# Altium project AMS_Master.PrjPCB
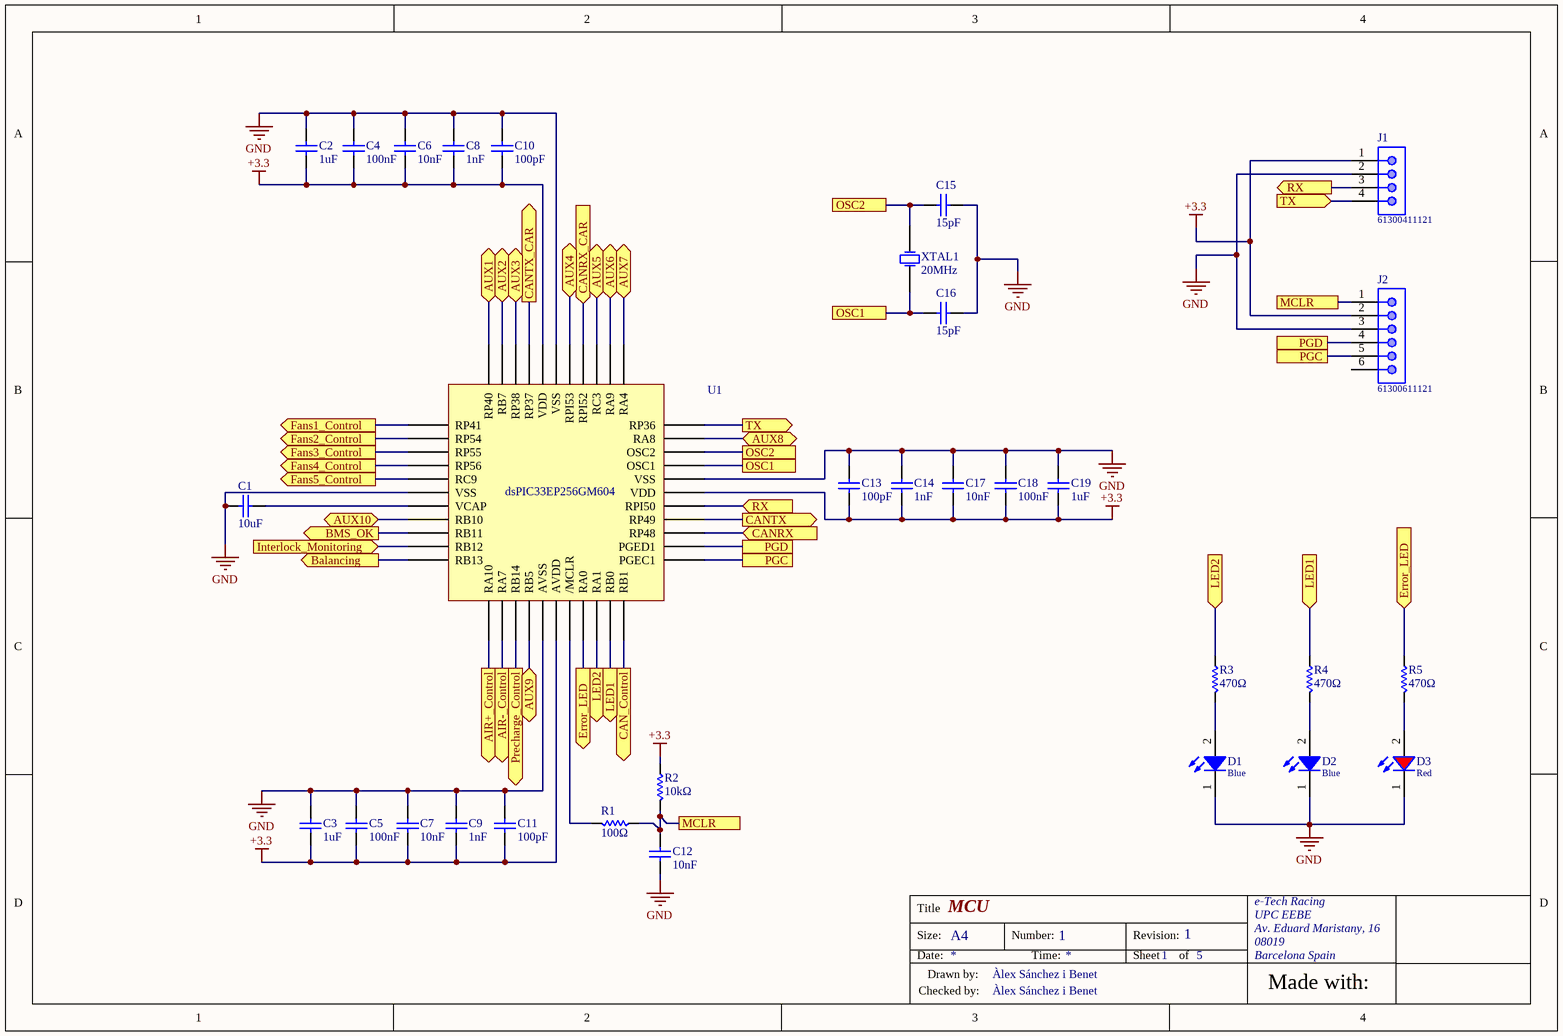
[diagram p0: AMS_MCU.SchDoc]
5 sheets, 95 parts. Net scope: flat (ports and power ports of the same name join across sheets).
Board file: AMS_Master.PcbDoc
Sheets:
  AMS_MCU.SchDoc
  AMS_supply.SchDoc
  AMS_Control.SchDoc
  AMS_Control_2.SchDoc
  AMS_CAN.SchDoc

## Sheet AMS_MCU.SchDoc: MCU
size A4; CheckedBy: Àlex Sánchez i Benet; DrawnBy: Àlex Sánchez i Benet; DocumentNumber: 1; Revision: 1; SheetNumber: 1; SheetTotal: 5; University: UPC EEBE; City: Barcelona; Country: Spain; CP: 08019; Address: Av. Eduard Maristany, 16

### Parts
C1  10uF  [0805_2x1.25x1.25mm_Reflow Soldering]
C2  1uF  [0805_2x1.25x1.25mm_Reflow Soldering]
C3  1uF  [0805_2x1.25x1.25mm_Reflow Soldering]
C4  100nF  [0805_2x1.25x0.8mm_Reflow Soldering]
C5  100nF  [0805_2x1.25x0.8mm_Reflow Soldering]
C6  10nF  [0805_2x1.25x0.8mm_Reflow Soldering]
C7  10nF  [0805_2x1.25x0.8mm_Reflow Soldering]
C8  1nF  [0805_2x1.25x0.8mm_Reflow Soldering]
C9  1nF  [0805_2x1.25x0.8mm_Reflow Soldering]
C10  100pF  [0805_2x1.25x0.6mm_Reflow Soldering]
C11  100pF  [0805_2x1.25x0.6mm_Reflow Soldering]
C12  10nF  [0805_2x1.25x0.8mm_Reflow Soldering]
C13  100pF  [0805_2x1.25x0.6mm_Reflow Soldering]
C14  1nF  [0805_2x1.25x0.8mm_Reflow Soldering]
C15  15pF  [0805_2x1.25x0.6mm_Reflow Soldering]
C16  15pF  [0805_2x1.25x0.6mm_Reflow Soldering]
C17  10nF  [0805_2x1.25x0.8mm_Reflow Soldering]
C18  100nF  [0805_2x1.25x0.8mm_Reflow Soldering]
C19  1uF  [0805_2x1.25x1.25mm_Reflow Soldering]
D1  Blue  [WL-SMCW_0805]
D2  Blue  [WL-SMCW_0805]
D3  Red  [WL-SMCW_0805]
J1  61300411121  [61300411121]
J2  61300611121  [61300611121]
R1  100Ω  [CR0805]
R2  10kΩ  [CR0805]
R3  470Ω  [CR0805]
R4  470Ω  [CR0805]
R5  470Ω  [CR0805]
U1  dsPIC33EP256GM604  [dsPIC33EP256GM604]
XTAL1  20MHz  [830028710]

### Ports
AIR+_Control (out), AIR-_Control (out), AUX1 (bidir), AUX2 (bidir), AUX3 (bidir), AUX4 (bidir), AUX5 (bidir), AUX6 (bidir), AUX7 (bidir), AUX8 (bidir), AUX9 (bidir), AUX10 (bidir), Balancing (out), BMS_OK (out), CAN_Control (out), CANRX (in), CANRX_CAR (in), CANTX (out), CANTX_CAR (out), Error_LED (in), Error_LED (out), Fans1_Control (out), Fans2_Control (out), Fans3_Control (out), Fans4_Control (out), Fans5_Control (out), Interlock_Monitoring (in), LED1 (in), LED1 (out), LED2 (in), LED2 (out), MCLR, OSC1, OSC2, PGC, PGD, Precharge_Control (out), RX (in), RX (out), TX (in), TX (out)

### Nets
+3.3: C2.1 C3.1 C4.1 C5.1 C6.1 C7.1 C8.1 C9.1 C10.1 C11.1 C13.1 C14.1 C17.1 C18.1 C19.1 J1.1 J2.2 R2.2 U1.17(AVDD) U1.28(VDD) U1.40(VDD)
GND: C1.2 C2.2 C3.2 C4.2 C5.2 C6.2 C7.2 C8.2 C9.2 C10.2 C11.2 C12.1 C13.2 C14.2 C15.2 C16.2 C17.2 C18.2 C19.2 D1.1(K) D2.1(K) D3.1(K) J1.2 J2.3 U1.6(VSS) U1.16(AVSS) U1.29(VSS) U1.39(VSS)
NetC1_1: C1.1 U1.7(VCAP)
NetC12_2: C12.2 J2.1 R1.2 R2.1 ; port MCLR
NetC15_1: C15.1 U1.31(OSC2) XTAL1.2(OSC2) ; port OSC2
NetC16_1: C16.1 U1.30(OSC1) XTAL1.1(OSC1) ; port OSC1
NetC23_2: U1.10(RB12) ; port Interlock_Monitoring
NetD1_2: D1.2(A) R3.1
NetD2_2: D2.2(A) R4.1
NetD3_2: D3.2(A) R5.1
NetD13_1: U1.11(RB13) ; port Balancing
NetJ1_3: J1.3 U1.27(RPI50) ; port RX
NetJ1_4: J1.4 U1.33(RP36) ; port TX
NetJ2_4: J2.4 U1.24(PGED1) ; port PGD
NetJ2_5: J2.5 U1.23(PGEC1) ; port PGC
NetQ1_1: U1.12(RA10) ; port AIR+_Control
NetQ2_1: U1.13(RA7) ; port AIR-_Control
NetQ3_1: U1.14(RB14) ; port Precharge_Control
NetQ4_1: U1.9(RB11) ; port BMS_OK
NetQ5_1: U1.1(RP41) ; port Fans1_Control
NetQ6_1: U1.2(RP54) ; port Fans2_Control
NetQ7_1: U1.22(RB1) ; port CAN_Control
NetR1_1: R1.1 U1.18(/MCLR)
NetR3_2: R3.2 U1.20(RA1) ; port LED2
NetR4_2: R4.2 U1.21(RB0) ; port LED1
NetR5_2: R5.2 U1.19(RA0) ; port Error_LED
NetU1_3: U1.3(RP55) ; port Fans3_Control
NetU1_4: U1.4(RP56) ; port Fans4_Control
NetU1_5: U1.5(RC9) ; port Fans5_Control
NetU1_8: U1.8(RB10) ; port AUX10
NetU1_15: U1.15(RB5) ; port AUX9
NetU1_25: U1.25(RP48) ; port CANRX
NetU1_26: U1.26(RP49) ; port CANTX
NetU1_32: U1.32(RA8) ; port AUX8
NetU1_34: U1.34(RA4) ; port AUX7
NetU1_35: U1.35(RA9) ; port AUX6
NetU1_36: U1.36(RC3) ; port AUX5
NetU1_37: U1.37(RPI52) ; port CANRX_CAR
NetU1_38: U1.38(RPI53) ; port AUX4
NetU1_41: U1.41(RP37) ; port CANTX_CAR
NetU1_42: U1.42(RP38) ; port AUX3
NetU1_43: U1.43(RB7) ; port AUX2
NetU1_44: U1.44(RP40) ; port AUX1

Not connected (* = marked no-connect by the designer): J2 6

### Notes on the sheet
- Title
- e-Tech Racing
- UPC EEBE
- Size:
- Date:
- Drawn by:
- A4
- Number:
- Time:
- Revision:
- Sheet
- of
- Av. Eduard Maristany, 16
- 08019
- Barcelona Spain
- Made with:
- Checked by:

### Library data of the parts
C1 = 885012107014: WCAP-CSGP Ceramic Capacitors, 0805, X5R, 16V, 10uF; Rated Voltage: 16V DC; ComponentLink1Description: Manufacturer; ComponentLink1URL: http://www.we-online.de; ComponentLink2Description: Datasheet; ComponentLink2URL: http://katalog.we-online.de/pbs/datasheet/885012107014.pdf; Part Number: 885012107014; Published Date: Oct. 2017; Publisher: Wurth Elektronik; Size: 0805; Operating Temperature: -55 °C to +125 °C; Value: 10uF; Ceramic Type: X5R
C2 C3 C19 = 885012207103: WCAP-CSGP Ceramic Capacitors, 0805, X7R, 50V, 1uF; Rated Voltage: 50V DC; ComponentLink1Description: Manufacturer; ComponentLink1URL: http://www.we-online.de; ComponentLink2Description: Datasheet; ComponentLink2URL: http://katalog.we-online.de/pbs/datasheet/885012207103.pdf; Part Number: 885012207103; Publisher: Wurth Elektronik; Size: 0805; Operating Temperature: -55 °C to +125 °C; Value: 1uF; Ceramic Type: X7R
C4 C5 C18 = 885012207098: WCAP-CSGP Ceramic Capacitors, 0805, X7R, 50V, 100nF; Rated Voltage: 50V DC; ComponentLink1Description: Manufacturer; ComponentLink1URL: http://www.we-online.de; ComponentLink2Description: Datasheet; ComponentLink2URL: http://katalog.we-online.de/pbs/datasheet/885012207098.pdf; Part Number: 885012207098; Publisher: Wurth Elektronik; Size: 0805; Operating Temperature: -55 °C to +125 °C; Value: 100nF; Ceramic Type: X7R
C6 C7 C12 C17 = 885012207092: WCAP-CSGP Ceramic Capacitors, 0805, X7R, 50V, 10nF; Rated Voltage: 50V DC; ComponentLink1Description: Manufacturer; ComponentLink1URL: http://www.we-online.de; ComponentLink2Description: Datasheet; ComponentLink2URL: http://katalog.we-online.de/pbs/datasheet/885012207092.pdf; Part Number: 885012207092; Publisher: Wurth Elektronik; Size: 0805; Operating Temperature: -55 °C to +125 °C; Value: 10nF; Ceramic Type: X7R
C8 C9 C14 = 885012007063: WCAP-CSGP Ceramic Capacitors, 0805, NP0, 50V, 1nF; Rated Voltage: 50V DC; ComponentLink1Description: Manufacturer; ComponentLink1URL: http://www.we-online.de; ComponentLink2Description: Datasheet; ComponentLink2URL: http://katalog.we-online.de/pbs/datasheet/885012007063.pdf; Part Number: 885012007063; Published Date: Oct. 2017; Publisher: Wurth Elektronik; Size: 0805; Operating Temperature: -55 °C to +125 °C; Value: 1nF; Ceramic Type: NP0
C10 C11 C13 = 885012007057: WCAP-CSGP Ceramic Capacitors, 0805, NP0, 50V, 100pF; Rated Voltage: 50V DC; ComponentLink1Description: Manufacturer; ComponentLink1URL: http://www.we-online.de; ComponentLink2Description: Datasheet; ComponentLink2URL: http://katalog.we-online.de/pbs/datasheet/885012007057.pdf; Part Number: 885012007057; Published Date: Oct. 2017; Publisher: Wurth Elektronik; Size: 0805; Operating Temperature: -55 °C to +125 °C; Value: 100pF; Ceramic Type: NP0
C15 C16 = 885012007052: WCAP-CSGP Ceramic Capacitors, 0805, NP0, 50V, 15pF; Rated Voltage: 50V DC; ComponentLink1Description: Manufacturer; ComponentLink1URL: http://www.we-online.de; ComponentLink2Description: Datasheet; ComponentLink2URL: http://katalog.we-online.de/pbs/datasheet/885012007052.pdf; Part Number: 885012007052; Published Date: Oct. 2017; Publisher: Wurth Elektronik; Size: 0805; Operating Temperature: -55 °C to +125 °C; Value: 15pF; Ceramic Type: NP0
D1 D2 = 150080BS75000: SMT Mono-color Chip LED Waterclear WL-SMCW, size 0805, Blue, 3.2 V, 140 deg, 145 mcd; Forward Voltage: 3.2 V; Viewing Angle: 140 deg; Peak Wavelength: 465 nm; Dominant Wavelength: 470 nm; Luminous Intensity: 145 mcd; Chip Technology: InGaN; ComponentLink1Description: Manufacturer; ComponentLink1URL: http://www.we-online.de; ComponentLink2Description: Datasheet; ComponentLink2URL: https://katalog.we-online.de/led/datasheet/150080BS75000.pdf; Part Number: 150080BS75000; Published Date: November 2018; Publisher: Wurth Elektronik; Size: 0805; Operating Temperature: -40 to 85 degC; Emitting Color: Blue; Mounting Technology: SMT; Packaging: Tape and Reel
D3 = 150080RS75000: SMT Mono-color Chip LED Waterclear WL-SMCW, size 0805, Red, 2 V, 140 deg, 150 mcd; Forward Voltage: 2 V; Viewing Angle: 140 deg; Peak Wavelength: 630 nm; Dominant Wavelength: 625 nm; Luminous Intensity: 150 mcd; Chip Technology: AlInGaP; ComponentLink1Description: Manufacturer; ComponentLink1URL: http://www.we-online.de; ComponentLink2Description: Datasheet; ComponentLink2URL: https://katalog.we-online.de/led/datasheet/150080RS75000.pdf; Part Number: 150080RS75000; Published Date: November 2018; Publisher: Wurth Elektronik; Size: 0805; Operating Temperature: -40 to 85 degC; Emitting Color: Red; Mounting Technology: SMT; Packaging: Tape and Reel
J1 = 61300411121: THT Vertical Pin Header WR-PHD, Pitch 2.54 mm, Single Row, 4 pins; Pin Number: 4; Pitch: 2.54 mm; Gender: Male; Rated Current: 3 A; Working Voltage: 250 VAC; Withstanding Voltage: 500 VAC; Contact Resistance: 20 mOhm; ComponentLink1Description: Manufacturer; ComponentLink1URL: http://www.we-online.de; ComponentLink2Description: Datasheet; ComponentLink2URL: https://katalog.we-online.de/em/datasheet/6130xx11121.pdf; Part Number: 61300411121; Published Date: August 2018; Publisher: Wurth Elektronik; Operating Temperature: -40 to 105 degC; Mounting Technology: THT; Packaging: Bag; Row Number: Single; Orientation: Vertical
J2 = 61300611121: THT Vertical Pin Header WR-PHD, Pitch 2.54 mm, Single Row, 6 pins; Pin Number: 6; Pitch: 2.54 mm; Gender: Male; Rated Current: 3 A; Working Voltage: 250 VAC; Withstanding Voltage: 500 VAC; Contact Resistance: 20 mOhm; ComponentLink1Description: Manufacturer; ComponentLink1URL: http://www.we-online.de; ComponentLink2Description: Datasheet; ComponentLink2URL: https://katalog.we-online.de/em/datasheet/6130xx11121.pdf; Part Number: 61300611121; Published Date: August 2018; Publisher: Wurth Elektronik; Operating Temperature: -40 to 105 degC; Mounting Technology: THT; Packaging: Bag; Row Number: Single; Orientation: Vertical
R1 = CR0805-FX-1000ELF: Chip Resistor 0805; Manufacturer: Bourns; ComponentLink1Description: Datasheet; ComponentLink1URL: https://www.bourns.com/docs/product-datasheets/chpreztr.pdf?sfvrsn=566c91f1_11
R2 = CR0805-JW-103ELF: Chip Resistor 0805; Manufacturer: Bourns; ComponentLink1Description: Datasheet; ComponentLink1URL: https://www.bourns.com/docs/product-datasheets/chpreztr.pdf?sfvrsn=566c91f1_11
R3-R5 = CR0805-FX-4700GLF: Chip Resistor 0805; Manufacturer: Bourns; ComponentLink1Description: Datasheet; ComponentLink1URL: https://www.bourns.com/docs/product-datasheets/chpreztr.pdf?sfvrsn=566c91f1_11
U1 = dsPIC33EP256GM604: 16-Bit Digital Signal Controller with High-Speed PWM, Op Amps and Advanced Analog Features; Manufacturer: Microchip; Pins: 44; ComponentLink1Description: Datasheet; ComponentLink1URL: http://ww1.microchip.com/downloads/en/DeviceDoc/70000689d.pdf
XTAL1 = 830028710: Industry standard SMD crystal WE-XTAL Quartz Crystal; Manufacturer: Wurth Elektronik; Model: HC49/4HSMX; ComponentLink1Description: Datasheet; ComponentLink1URL: https://katalog.we-online.com/pbs/datasheet/830028710.pdf; Mounting Technology: SMT; Frequency: 20MHz

## Sheet AMS_supply.SchDoc: Supply Circuit
size A4; CheckedBy: Àlex Sánchez i Benet; DrawnBy: Àlex Sánchez i Benet; DocumentNumber: 1; Revision: 1; SheetNumber: 2; SheetTotal: 5; University: UPC EEBE; City: Barcelona; Country: Spain; CP: 08019; Address: Av. Eduard Maristany, 16
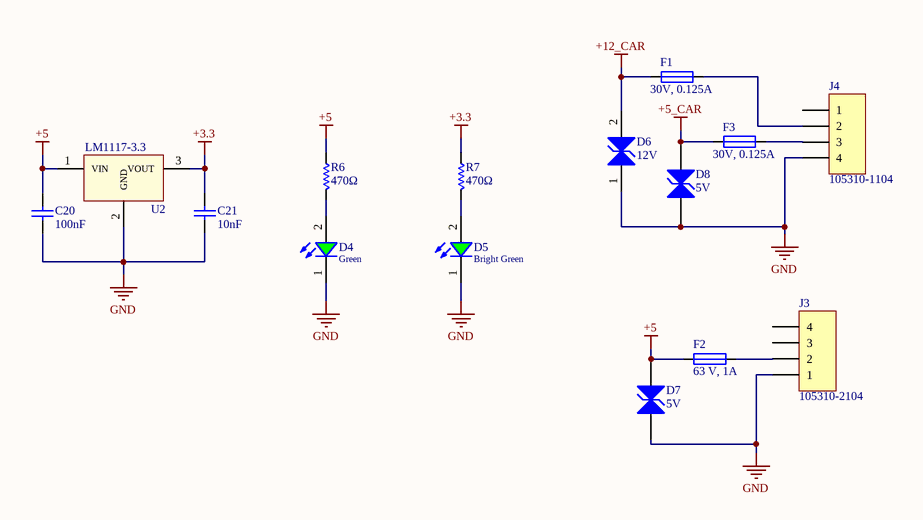
[diagram p1: AMS_supply.SchDoc]

### Parts
C20  100nF  [0805_2x1.25x0.8mm_Reflow Soldering]
C21  10nF  [0805_2x1.25x0.8mm_Reflow Soldering]
D4  Green  [WL-SMCW_0805]
D5  Bright Green  [WL-SMCW_0805]
D6  12V  [WE-TVSP_DO-214AC_Bidirectional]
D7  5V  [WE-TVSP_DO-214AC_Bidirectional]
D8  5V  [WE-TVSP_DO-214AC_Bidirectional]
F1  30V, 0.125A  [1206L012]
F2  63 V, 1A  [437 Series]
F3  30V, 0.125A  [1206L012]
J3  105310-2104  [105310-2104]
J4  105310-1104  [105310-1104]
R6  470Ω  [CR0805]
R7  470Ω  [CR0805]
U2  Reference: LM1117-3.3  [LM1117IMP3.3]  (hidden comment: 1.5 - 13.8 Vin, 3.3 Vout)

### Nets
+3.3: C21.2 R7.2 U2.3(VOUT)
+5: C20.2 D7.2(C) F2.1 R6.2 U2.1(VIN)
+5_CAR: D8.2(C) F3.1
+12_CAR: D6.2(C) F1.1
GND: C20.1 C21.1 D4.1(K) D5.1(K) D6.1(C) D7.1(C) D8.1(C) J3.1 J4.4 U2.2(GND)
NetD4_2: D4.2(A) R6.1
NetD5_2: D5.2(A) R7.1
NetF1_2: F1.2 J4.2
NetF2_2: F2.2 J3.2
NetF3_2: F3.2 J4.3

Not connected (* = marked no-connect by the designer): J3 3 4; J4 1

### Notes on the sheet
- Title
- e-Tech Racing
- UPC EEBE
- Size:
- Date:
- Drawn by:
- A4
- Number:
- Time:
- Revision:
- Sheet
- of
- Av. Eduard Maristany, 16
- 08019
- Barcelona Spain
- Made with:
- Checked by:

### Library data of the parts
C20 = 885012207098: as C4 on sheet AMS_MCU; ComponentLink1Description: Manufacturer; ComponentLink1URL: http://www.we-online.de; ComponentLink2Description: Datasheet; ComponentLink2URL: http://katalog.we-online.de/pbs/datasheet/885012207098.pdf; Part Number: 885012207098; Publisher: Wurth Elektronik; Size: 0805; Operating Temperature: -55 °C to +125 °C; Value: 100nF; Ceramic Type: X7R
C21 = 885012207092: as C6 on sheet AMS_MCU; ComponentLink1Description: Manufacturer; ComponentLink1URL: http://www.we-online.de; ComponentLink2Description: Datasheet; ComponentLink2URL: http://katalog.we-online.de/pbs/datasheet/885012207092.pdf; Part Number: 885012207092; Publisher: Wurth Elektronik; Size: 0805; Operating Temperature: -55 °C to +125 °C; Value: 10nF; Ceramic Type: X7R
D4 = 150080GS75000: SMT Mono-color Chip LED Waterclear WL-SMCW, size 0805, Green, 3.2 V, 140 deg, 450 mcd; Forward Voltage: 3.2 V; Viewing Angle: 140 deg; Peak Wavelength: 515 nm; Dominant Wavelength: 525 nm; Luminous Intensity: 450 mcd; Chip Technology: InGaN; ComponentLink1Description: Manufacturer; ComponentLink1URL: http://www.we-online.de; ComponentLink2Description: Datasheet; ComponentLink2URL: https://katalog.we-online.de/led/datasheet/150080GS75000.pdf; Part Number: 150080GS75000; Published Date: November 2018; Publisher: Wurth Elektronik; Size: 0805; Operating Temperature: -40 to 85 degC; Emitting Color: Green; Mounting Technology: SMT; Packaging: Tape and Reel
D5 = 150080VS75000: SMT Mono-color Chip LED Waterclear WL-SMCW, size 0805, Bright Green, 2 V, 140 deg, 40 mcd; Forward Voltage: 2 V; Viewing Angle: 140 deg; Peak Wavelength: 572 nm; Dominant Wavelength: 570 nm; Luminous Intensity: 40 mcd; Chip Technology: AlInGaP; ComponentLink1Description: Manufacturer; ComponentLink1URL: http://www.we-online.de; ComponentLink2Description: Datasheet; ComponentLink2URL: https://katalog.we-online.de/led/datasheet/150080VS75000.pdf; Part Number: 150080VS75000; Published Date: November 2018; Publisher: Wurth Elektronik; Size: 0805; Operating Temperature: -40 to 85 degC; Emitting Color: Bright Green; Mounting Technology: SMT; Packaging: Tape and Reel
D6 = 824501121: WE-TVSP Power TVS Diode, size DO-214AC, Bidirectional, 400 W, 12 VDC; Peak Pulse Current: 20.1 A; Power Dissipation: 400 W; Reverse Breakdown Voltage: 14 V; Surge Clamping Voltage: 19.9 V; ComponentLink1Description: Manufacturer; ComponentLink1URL: http://www.we-online.de; ComponentLink2Description: Datasheet; ComponentLink2URL: https://katalog.we-online.de/pbs/datasheet/824501121.pdf; Part Number: 824501121; Publisher: Wurth Elektronik; Size: DO-214AC; Operating Temperature: -65 to 150 degC; Mounting Technology: SMT; Packaging: Tape and Reel; Polarity: Bidirectional; Reverse Stand-Off Voltage: 12 V
D7 D8 = 824501500: WE-TVSP Power TVS Diode, size DO-214AC, Bidirectional, 400 W, 5 VDC; Manufacturer: Wurth Elektronik; Peak Pulse Current: 43.5 A; Power Dissipation: 400 W; Reverse Breakdown Voltage: 6.7 V; Surge Clamping Voltage: 9.2 V; ComponentLink1Description: Manufacturer; ComponentLink1URL: http://www.we-online.de; ComponentLink2Description: Datasheet; ComponentLink2URL: https://katalog.we-online.de/pbs/datasheet/824501500.pdf; Part Number: 824501500; Size: DO-214AC; Operating Temperature: -65ºC to 150 ºC; Mounting Technology: SMT; Packaging: Tape and Reel; Polarity: Bidirectional; Reverse Stand-Off Voltage: 5 V
F1 F3 = 1206L012: 1206L Series; Manufacturer: Littlefuse; ComponentLink1Description: Datasheet; ComponentLink1URL: https://www.littelfuse.com/~/media/electronics/datasheets/resettable_ptcs/littelfuse_ptc_1206l_datasheet.pdf.pdf
F2 = 0437001A: 437A Series Fuse; Manufacturer: Littlefuse; ComponentLink1Description: Datasheet; ComponentLink1URL: https://www.littelfuse.com/~/media/electronics/datasheets/fuses/littelfuse_fuse_437a_datasheet.pdf.pdf
J3 = 105310-2104: Nano-Fit Vertical Header, Through Hole, 2.50mm Pitch, Dual Row, 4 Circuits, Natural; Manufacturer: Molex; Rated Voltage: 250V DC; Rated Current: 6.5A; Operating Temperature: -40° to +105°C; ComponentLink1Description: Datasheet; ComponentLink1URL: https://www.molex.com/webdocs/datasheets/pdf/en-us/1053102104_PCB_HEADERS.pdf
J4 = 105310-1104: Nano-Fit Vertical Header, Through Hole, 2.50mm Pitch, Dual Row, 4 Circuits, Black; Manufacturer: Molex; Rated Voltage: 250V DC; Rated Current: 6.5A; Operating Temperature: -40° to +105°C; ComponentLink2Description: Datasheet; ComponentLink2URL: https://www.molex.com/webdocs/datasheets/pdf/en-us/1053101104_PCB_HEADERS.pdf
R6 R7 = CR0805-FX-4700GLF: Chip Resistor 0805; Manufacturer: Bourns; ComponentLink1Description: Datasheet; ComponentLink1URL: https://www.bourns.com/docs/product-datasheets/chpreztr.pdf?sfvrsn=566c91f1_11
U2 = LM1117IMP-3.3/NOPB: 800-mA Low-Dropout Linear Regulator; Manufacturer: Texas Instruments; Output Voltage: 3.3 V; Output Current: 800 mA; Input Voltage: 1.5-13.8 V; ComponentLink1Description: Datasheet; ComponentLink1URL: http://www.ti.com/lit/ds/symlink/lm1117.pdf

## Sheet AMS_Control.SchDoc: Control Circuit 1
size A4; CheckedBy: Àlex Sánchez i Benet; DrawnBy: Àlex Sánchez i Benet; DocumentNumber: 1; Revision: 1; SheetNumber: 3; SheetTotal: 5; University: UPC EEBE; City: Barcelona; Country: Spain; CP: 08019; Address: Av. Eduard Maristany, 16
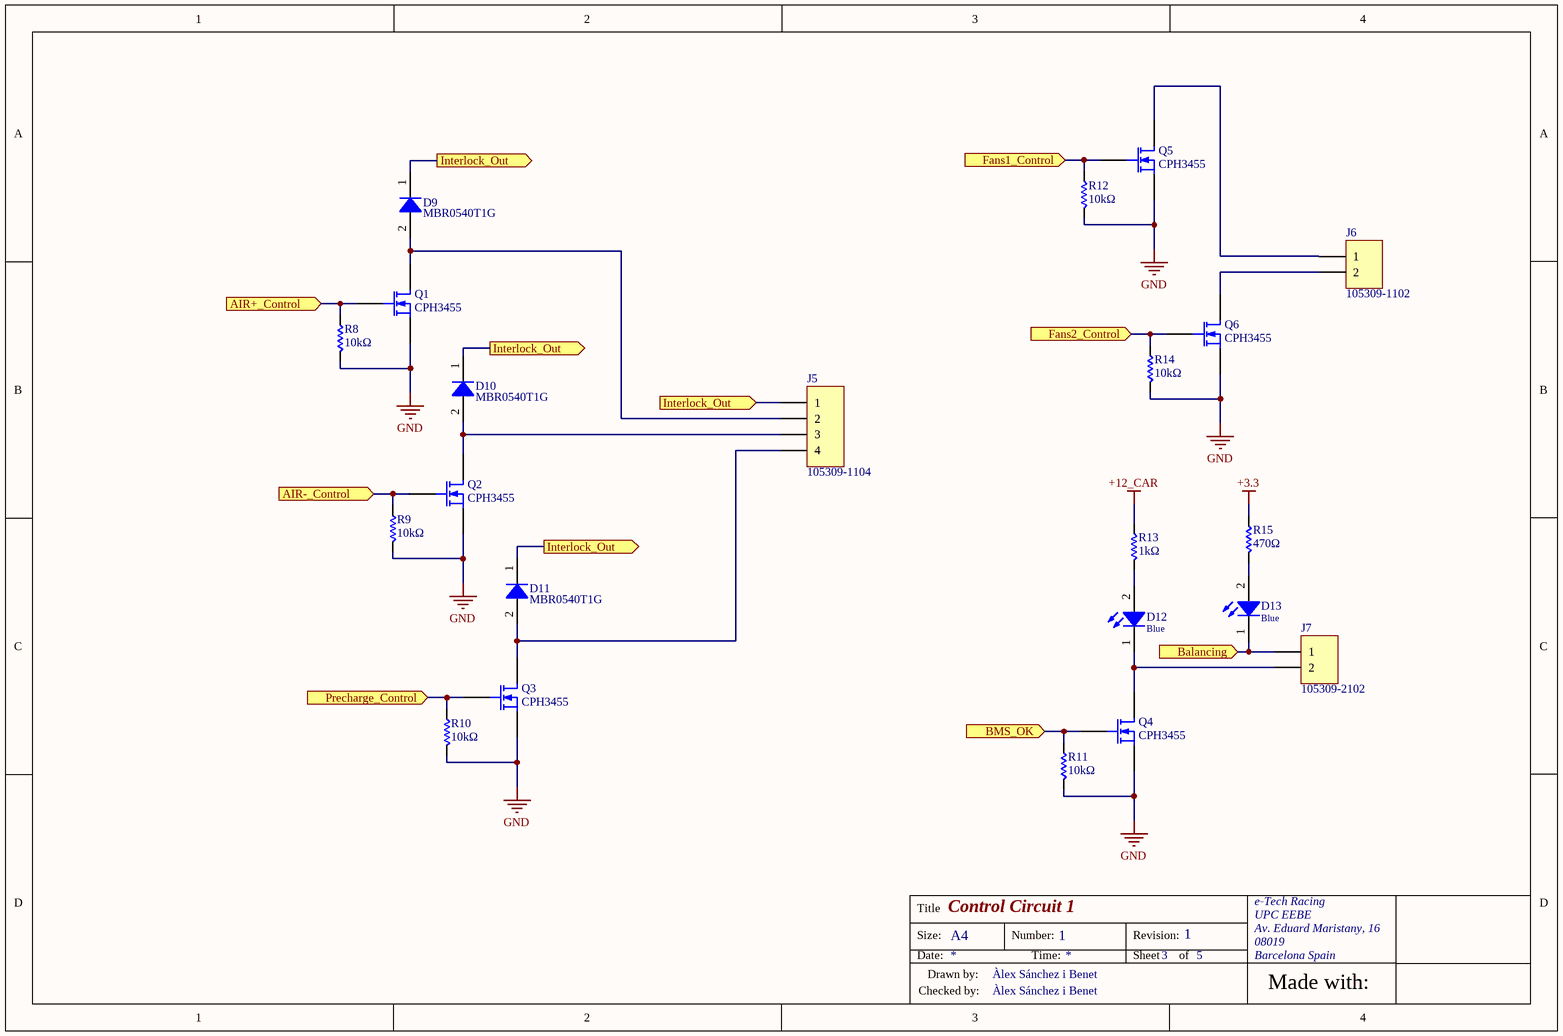
[diagram p2: AMS_Control.SchDoc]

### Parts
D9  MBR0540T1G  [MBR0540T1G]
D10  MBR0540T1G  [MBR0540T1G]
D11  MBR0540T1G  [MBR0540T1G]
D12  Blue  [WL-SMCW_0805]
D13  Blue  [WL-SMCW_0805]
J5  105309-1104  [105309-1104]
J6  105309-1102  [105309-1102]
J7  105309-2102  [105309-2102]
Q1  CPH3455  [CPH3455]
Q2  CPH3455  [CPH3455]
Q3  CPH3455  [CPH3455]
Q4  CPH3455  [CPH3455]
Q5  CPH3455  [CPH3455]
Q6  CPH3455  [CPH3455]
R8  10kΩ  [CR0805]
R9  10kΩ  [CR0805]
R10  10kΩ  [CR0805]
R11  10kΩ  [CR0805]
R12  10kΩ  [CR0805]
R13  1kΩ  [CR0805]
R14  10kΩ  [CR0805]
R15  470Ω  [CR0805]

### Ports
AIR+_Control (in), AIR-_Control (in), Balancing (in), BMS_OK (in), Fans1_Control (in), Fans2_Control (in), Interlock_Out (in), Interlock_Out (out), Precharge_Control (in)

### Nets
+3.3: R15.2
+12_CAR: R13.2
GND: Q1.2(S) Q2.2(S) Q3.2(S) Q4.2(S) Q5.2(S) Q6.2(S) R8.1 R9.1 R10.1 R11.1 R12.1 R14.1
NetD9_1: D9.1(K) D10.1(K) D11.1(K) J5.1 ; port Interlock_Out
NetD9_2: D9.2(A) J5.2 Q1.3(D)
NetD10_2: D10.2(A) J5.3 Q2.3(D)
NetD11_2: D11.2(A) J5.4 Q3.3(D)
NetD12_1: D12.1(K) J7.2 Q4.3(D)
NetD12_2: D12.2(A) R13.1
NetD13_1: D13.1(K) J7.1 ; port Balancing
NetD13_2: D13.2(A) R15.1
NetJ6_1: J6.1 Q5.3(D)
NetJ6_2: J6.2 Q6.3(D)
NetQ1_1: Q1.1(G) R8.2 ; port AIR+_Control
NetQ2_1: Q2.1(G) R9.2 ; port AIR-_Control
NetQ3_1: Q3.1(G) R10.2 ; port Precharge_Control
NetQ4_1: Q4.1(G) R11.2 ; port BMS_OK
NetQ5_1: Q5.1(G) R12.2 ; port Fans1_Control
NetQ6_1: Q6.1(G) R14.2 ; port Fans2_Control

### Notes on the sheet
- Title
- e-Tech Racing
- UPC EEBE
- Size:
- Date:
- Drawn by:
- A4
- Number:
- Time:
- Revision:
- Sheet
- of
- Av. Eduard Maristany, 16
- 08019
- Barcelona Spain
- Made with:
- Checked by:

### Library data of the parts
D9-D11 = MBR0540T1G: Surface Mount Schottky Power Rectifier; Manufacturer: On Semiconductor; ComponentLink1Description: Datasheet; ComponentLink1URL: https://www.onsemi.com/pub/Collateral/MBR0540T1-D.PDF
D12 D13 = 150080BS75000: as D1 on sheet AMS_MCU; ComponentLink1Description: Manufacturer; ComponentLink1URL: http://www.we-online.de; ComponentLink2Description: Datasheet; ComponentLink2URL: https://katalog.we-online.de/led/datasheet/150080BS75000.pdf; Part Number: 150080BS75000; Published Date: November 2018; Publisher: Wurth Elektronik; Size: 0805; Operating Temperature: -40 to 85 degC; Emitting Color: Blue; Mounting Technology: SMT; Packaging: Tape and Reel
J5 = 105309-1104: Nano-Fit Vertical Header, Through Hole, 2.50mm Pitch, Single Row, 4 Circuits, Black; Manufacturer: Molex; Rated Voltage: 250V DC; Rated Current: 6.5A; Operating Temperature: -40° to +105°C; ComponentLink1Description: Datasheet; ComponentLink1URL: https://www.molex.com/webdocs/datasheets/pdf/en-us/1053091104_PCB_HEADERS.pdf
J6 = 105309-1102: Nano-Fit Vertical Header, Through Hole, 2.50mm Pitch, Single Row, 2 Circuits, Black; Manufacturer: Molex; Rated Voltage: 250V DC; Rated Current: 6.5A; Operating Temperature: -40° to +105°C; ComponentLink1Description: Datahsheet; ComponentLink1URL: https://www.molex.com/webdocs/datasheets/pdf/en-us/1053091103_PCB_HEADERS.pdf
J7 = 105309-2102: Nano-Fit Vertical Header, Through Hole, 2.50mm Pitch, Single Row, 2 Circuits, Natural; Manufacturer: Molex; Rated Voltage: 250V DC; Rated Current: 6.5A; Operating Temperature: -40° to +105°C; ComponentLink1Description: Datasheet; ComponentLink1URL: https://www.molex.com/webdocs/datasheets/pdf/en-us/1053092102_PCB_HEADERS.pdf
Q1-Q6 = CPH3455: Power MOSFET 35V, 104mΩ, 3A, Single N-Channel; Manufacturer: ON Semiconductors; ComponentLink1Description: Datasheet; ComponentLink1URL: https://www.onsemi.com/pub/Collateral/CPH3455-D.PDF
R8-R14 = CR0805-JW-103ELF: Chip Resistor 0805; Manufacturer: Bourns; ComponentLink1Description: Datasheet; ComponentLink1URL: https://www.bourns.com/docs/product-datasheets/chpreztr.pdf?sfvrsn=566c91f1_11
R15 = CR0805-FX-4700GLF: Chip Resistor 0805; Manufacturer: Bourns; ComponentLink1Description: Datasheet; ComponentLink1URL: https://www.bourns.com/docs/product-datasheets/chpreztr.pdf?sfvrsn=566c91f1_11

## Sheet AMS_Control_2.SchDoc: Control Circuit 2
size A4; CheckedBy: Àlex Sánchez i Benet; DrawnBy: Àlex Sánchez i Benet; DocumentNumber: 1; Revision: 1; SheetNumber: 4; SheetTotal: 5; University: UPC EEBE; City: Barcelona; Country: Spain; CP: 08019; Address: Av. Eduard Maristany, 16
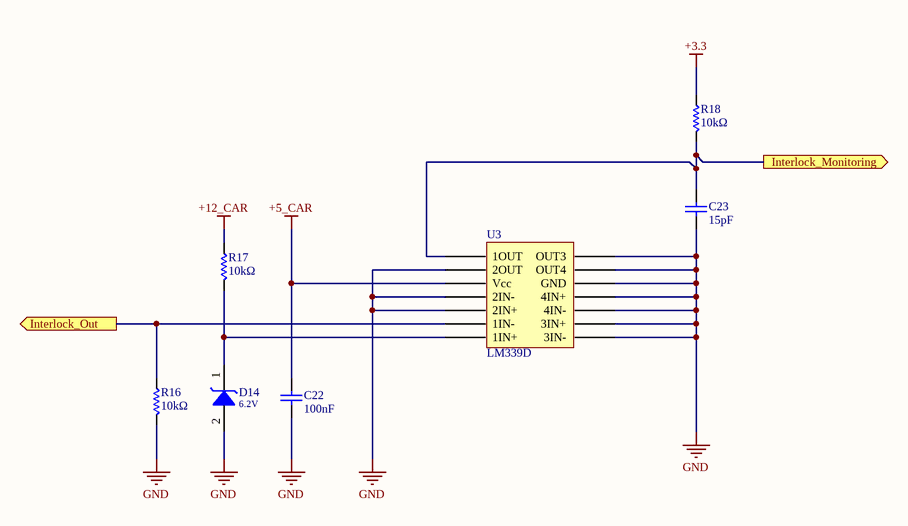
[diagram p3: AMS_Control_2.SchDoc]

### Parts
C22  100nF  [0805_2x1.25x0.8mm_Reflow Soldering]
C23  15pF  [0805_2x1.25x0.6mm_Reflow Soldering]
D14  6.2V  [BZG05C-M-Series]
R16  10kΩ  [CR0805]
R17  10kΩ  [CR0805]
R18  10kΩ  [CR0805]
U3  LM339D  [LM339D]

### Ports
Interlock_Monitoring (out), Interlock_Out (out)

### Nets
+3.3: R18.2
+5_CAR: C22.2 U3.3(Vcc)
+12_CAR: R17.2
GND: C22.1 C23.1 D14.2(A) R16.1 U3.2(2OUT) U3.4(2IN-) U3.5(2IN+) U3.8(3IN-) U3.9(3IN+) U3.10(4IN-) U3.11(4IN+) U3.12(GND) U3.13(OUT4) U3.14(OUT3)
NetC23_2: C23.2 R18.1 U3.1(1OUT) ; port Interlock_Monitoring
NetD9_1: R16.2 U3.6(1IN-) ; port Interlock_Out
NetD14_1: D14.1(K) R17.1 U3.7(1IN+)

### Notes on the sheet
- Title
- e-Tech Racing
- UPC EEBE
- Size:
- Date:
- Drawn by:
- A4
- Number:
- Time:
- Revision:
- Sheet
- of
- Av. Eduard Maristany, 16
- 08019
- Barcelona Spain
- Made with:
- Checked by:

### Library data of the parts
C22 = 885012207098: as C4 on sheet AMS_MCU; ComponentLink1Description: Manufacturer; ComponentLink1URL: http://www.we-online.de; ComponentLink2Description: Datasheet; ComponentLink2URL: http://katalog.we-online.de/pbs/datasheet/885012207098.pdf; Part Number: 885012207098; Publisher: Wurth Elektronik; Size: 0805; Operating Temperature: -55 °C to +125 °C; Value: 100nF; Ceramic Type: X7R
C23 = 885012007052: as C15 on sheet AMS_MCU; ComponentLink1Description: Manufacturer; ComponentLink1URL: http://www.we-online.de; ComponentLink2Description: Datasheet; ComponentLink2URL: http://katalog.we-online.de/pbs/datasheet/885012007052.pdf; Part Number: 885012007052; Published Date: Oct. 2017; Publisher: Wurth Elektronik; Size: 0805; Operating Temperature: -55 °C to +125 °C; Value: 15pF; Ceramic Type: NP0
D14 = BZG05C6V2-E3-TR: Zener Diode; Manufacturer: Vishay; ComponentLink1Description: Datasheet; ComponentLink1URL: http://www.vishay.com/docs/86135/bzg05c-m-series.pdf
R16-R18 = CR0805-JW-103ELF: Chip Resistor 0805; Manufacturer: Bourns; ComponentLink1Description: Datasheet; ComponentLink1URL: https://www.bourns.com/docs/product-datasheets/chpreztr.pdf?sfvrsn=566c91f1_11
U3 = LM339D: Quad Differential / Comparators; Manufacturer: Texas Instrument; Pins: 14; ComponentLink1Description: Datasheet; ComponentLink1URL: http://www.ti.com/lit/ds/symlink/lm339.pdf

## Sheet AMS_CAN.SchDoc: CAN
size A4; CheckedBy: Àlex Sánchez i Benet; DrawnBy: Àlex Sánchez i Benet; DocumentNumber: 1; Revision: 1; SheetNumber: 5; SheetTotal: 5; University: UPC EEBE; City: Barcelona; Country: Spain; CP: 08019; Address: Av. Eduard Maristany, 16
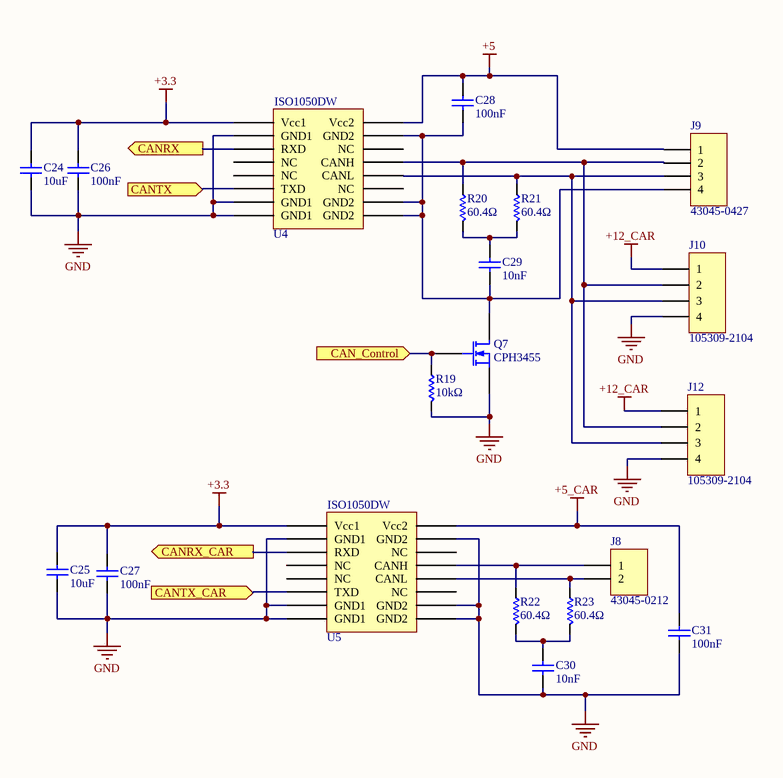
[diagram p4: AMS_CAN.SchDoc]

### Parts
C24  10uF  [0805_2x1.25x1.25mm_Reflow Soldering]
C25  10uF  [0805_2x1.25x1.25mm_Reflow Soldering]
C26  100nF  [0805_2x1.25x0.8mm_Reflow Soldering]
C27  100nF  [0805_2x1.25x0.8mm_Reflow Soldering]
C28  100nF  [0805_2x1.25x0.8mm_Reflow Soldering]
C29  10nF  [0805_2x1.25x0.8mm_Reflow Soldering]
C30  10nF  [0805_2x1.25x0.8mm_Reflow Soldering]
C31  100nF  [0805_2x1.25x0.8mm_Reflow Soldering]
J8  43045-0212  [43045-0212]
J9  43045-0427  [43045-0427]
J10  105309-2104  [105309-2104]
J12  105309-2104  [105309-2104]
Q7  CPH3455  [CPH3455]
R19  10kΩ  [CR0805]
R20  60.4Ω  [CR0805]
R21  60.4Ω  [CR0805]
R22  60.4Ω  [CR0805]
R23  60.4Ω  [CR0805]
U4  ISO1050DW  [ISO1050DW]
U5  ISO1050DW  [ISO1050DW]

### Ports
CAN_Control (in), CANRX (out), CANRX_CAR (out), CANTX (in), CANTX_CAR (in)

### Nets
+3.3: C24.2 C25.2 C26.2 C27.2 U4.1(Vcc1) U5.1(Vcc1)
+5: C28.2 J9.1 U4.16(Vcc2)
+5_CAR: C31.2 U5.16(Vcc2)
+12_CAR: J10.1 J12.1
GND: C24.1 C25.1 C26.1 C27.1 C30.1 C31.1 J10.4 J12.4 Q7.2(S) R19.1 U4.2(GND1) U4.7(GND1) U4.8(GND1) U5.2(GND1) U5.7(GND1) U5.8(GND1) U5.9(GND2) U5.10(GND2) U5.15(GND2)
NetC28_1: C28.1 C29.1 J9.4 Q7.3(D) U4.9(GND2) U4.10(GND2) U4.15(GND2)
NetC29_2: C29.2 R20.1 R21.1
NetC30_2: C30.2 R22.1 R23.1
NetJ8_1: J8.1 R22.2 U5.13(CANH)
NetJ8_2: J8.2 R23.2 U5.12(CANL)
NetJ9_2: J9.2 J10.2 J12.2 R20.2 U4.13(CANH)
NetJ9_3: J9.3 J10.3 J12.3 R21.2 U4.12(CANL)
NetQ7_1: Q7.1(G) R19.2 ; port CAN_Control
NetU1_25: U4.3(RXD) ; port CANRX
NetU1_26: U4.6(TXD) ; port CANTX
NetU1_37: U5.3(RXD) ; port CANRX_CAR
NetU1_41: U5.6(TXD) ; port CANTX_CAR

Not connected (* = marked no-connect by the designer): U4 4(NC) 5(NC) 11(NC) 14(NC); U5 4(NC) 5(NC) 11(NC) 14(NC)

### Notes on the sheet
- Title
- e-Tech Racing
- UPC EEBE
- Size:
- Date:
- Drawn by:
- A4
- Number:
- Time:
- Revision:
- Sheet
- of
- Av. Eduard Maristany, 16
- 08019
- Barcelona Spain
- Made with:
- Checked by:

### Library data of the parts
C24 C25 = 885012107014: as C1 on sheet AMS_MCU; ComponentLink1Description: Manufacturer; ComponentLink1URL: http://www.we-online.de; ComponentLink2Description: Datasheet; ComponentLink2URL: http://katalog.we-online.de/pbs/datasheet/885012107014.pdf; Part Number: 885012107014; Published Date: Oct. 2017; Publisher: Wurth Elektronik; Size: 0805; Operating Temperature: -55 °C to +125 °C; Value: 10uF; Ceramic Type: X5R
C26-C28 C31 = 885012207098: as C4 on sheet AMS_MCU; ComponentLink1Description: Manufacturer; ComponentLink1URL: http://www.we-online.de; ComponentLink2Description: Datasheet; ComponentLink2URL: http://katalog.we-online.de/pbs/datasheet/885012207098.pdf; Part Number: 885012207098; Publisher: Wurth Elektronik; Size: 0805; Operating Temperature: -55 °C to +125 °C; Value: 100nF; Ceramic Type: X7R
C29 C30 = 885012207092: as C6 on sheet AMS_MCU; ComponentLink1Description: Manufacturer; ComponentLink1URL: http://www.we-online.de; ComponentLink2Description: Datasheet; ComponentLink2URL: http://katalog.we-online.de/pbs/datasheet/885012207092.pdf; Part Number: 885012207092; Publisher: Wurth Elektronik; Size: 0805; Operating Temperature: -55 °C to +125 °C; Value: 10nF; Ceramic Type: X7R
J8 = 43045-0212: Micro-Fit 3.0 Vertical Header, 3.00mm Pitch, Dual Row, 2 Circuits, Black; Manufacturer: Molex; Rated Voltage: 600V DC; Rated Current: 8.5A; Number of Row: 1; Circuits: 2; Operating Temperature: -40° to +105°C; ComponentLink1Description: Datasheet; ComponentLink1URL: https://www.molex.com/webdocs/datasheets/pdf/en-us/0430450212_PCB_HEADERS.pdf
J9 = 43045-0427: Micro-Fit 3.0 Vertical Header, 3.00mm Pitch, Dual Row, 4 Circuits, Black; Manufacturer: Molex; Rated Voltage: 600V DC; Rated Current: 8.5A; Circuits: 4; Operating Temperature: -40° to +105°C; Number of Rows: 2; ComponentLink1Description: Datasheet; ComponentLink1URL: https://www.molex.com/webdocs/datasheets/pdf/en-us/0430450427_PCB_HEADERS.pdf
J10 J12 = 105309-2104: Nano-Fit Vertical Header, Through Hole, 2.50mm Pitch, Single Row, 4 Circuits, Natural; Manufacturer: Molex; Rated Voltage: 250V DC; Rated Current: 6.5A; Operating Temperature: -40° to +105°C; ComponentLink1Description: Datasheet; ComponentLink1URL: https://www.molex.com/pdm_docs/sd/1053092104_sd.pdf
Q7 = CPH3455: as Q1 on sheet AMS_Control; ComponentLink1Description: Datasheet; ComponentLink1URL: https://www.onsemi.com/pub/Collateral/CPH3455-D.PDF
R19 = CR0805-JW-103ELF: Chip Resistor 0805; Manufacturer: Bourns; ComponentLink1Description: Datasheet; ComponentLink1URL: https://www.bourns.com/docs/product-datasheets/chpreztr.pdf?sfvrsn=566c91f1_11
R20-R23 = ERA6AEB60R4V: Chip Resistor 0805; Manufacturer: Panasonic; ComponentLink1Description: Datasheet; ComponentLink1URL: https://www.bourns.com/docs/product-datasheets/chpreztr.pdf?sfvrsn=566c91f1_11
U4 U5 = ISO1050DW: Galvanically isolated CAN / transceiver; Manufacturer: Texas Instruments; Pins: 16; ComponentLink1Description: Datasheet; ComponentLink1URL: http://www.ti.com/lit/ds/symlink/iso1050.pdf

## Nets that join several sheets
+3.3: AMS_MCU (21 pins), AMS_supply (C21.2 R7.2 U2.3), AMS_Control (R15.2), AMS_Control_2 (R18.2), AMS_CAN (6 pins)
+5: AMS_supply (5 pins), AMS_CAN (C28.2 J9.1 U4.16)
+5_CAR: AMS_supply (D8.2 F3.1), AMS_Control_2 (C22.2 U3.3), AMS_CAN (C31.2 U5.16)
+12_CAR: AMS_supply (D6.2 F1.1), AMS_Control (R13.2), AMS_Control_2 (R17.2), AMS_CAN (J10.1 J12.1)
GND: AMS_MCU (28 pins), AMS_supply (10 pins), AMS_Control (12 pins), AMS_Control_2 (14 pins), AMS_CAN (19 pins)
NetC23_2: AMS_MCU (U1.10), AMS_Control_2 (C23.2 R18.1 U3.1)
NetD9_1: AMS_Control (D9.1 D10.1 D11.1 J5.1), AMS_Control_2 (R16.2 U3.6)
NetD13_1: AMS_MCU (U1.11), AMS_Control (D13.1 J7.1)
NetQ1_1: AMS_MCU (U1.12), AMS_Control (Q1.1 R8.2)
NetQ2_1: AMS_MCU (U1.13), AMS_Control (Q2.1 R9.2)
NetQ3_1: AMS_MCU (U1.14), AMS_Control (Q3.1 R10.2)
NetQ4_1: AMS_MCU (U1.9), AMS_Control (Q4.1 R11.2)
NetQ5_1: AMS_MCU (U1.1), AMS_Control (Q5.1 R12.2)
NetQ6_1: AMS_MCU (U1.2), AMS_Control (Q6.1 R14.2)
NetQ7_1: AMS_MCU (U1.22), AMS_CAN (Q7.1 R19.2)
NetU1_25: AMS_MCU (U1.25), AMS_CAN (U4.3)
NetU1_26: AMS_MCU (U1.26), AMS_CAN (U4.6)
NetU1_37: AMS_MCU (U1.37), AMS_CAN (U5.3)
NetU1_41: AMS_MCU (U1.41), AMS_CAN (U5.6)